# Altium schematic sheet frm-voltrod.SchDoc: MAIN
size A3; DocumentNumber: 1; SheetNumber: 1; SheetTotal: 3
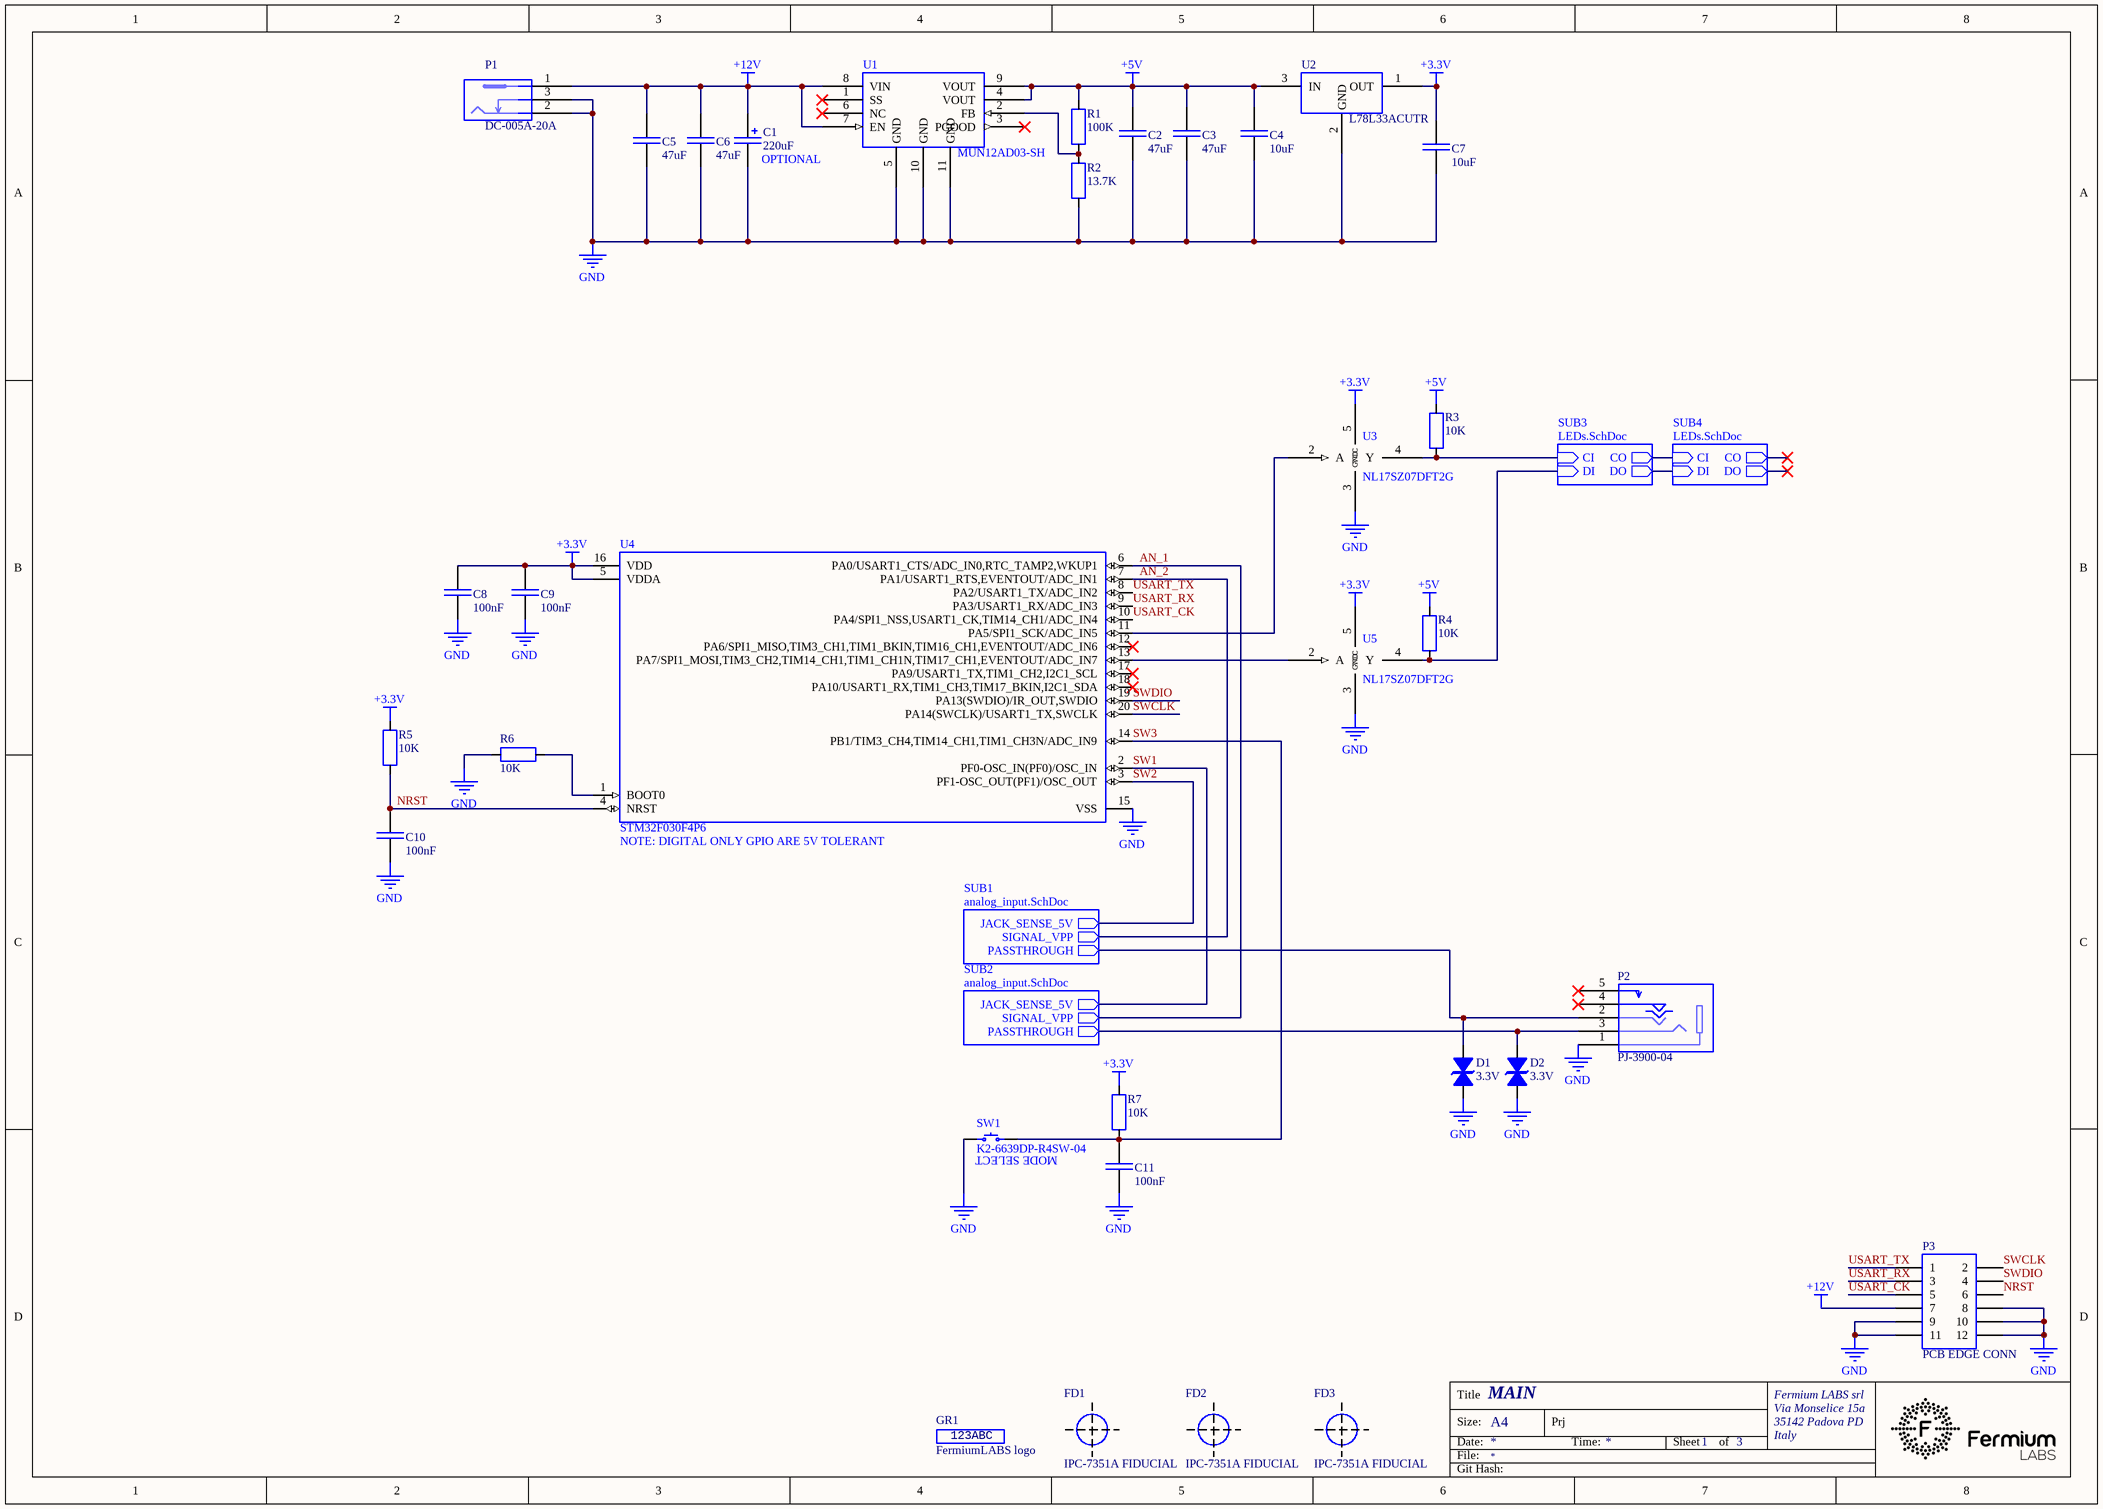
[diagram p0: frm-voltrod.SchDoc]

## Parts
C1  220uF  [3924B366-8672-45E9-B0BE-62DACC24E783]
C2  47uF  [CAP 0805_2012]
C3  47uF  [CAP 0805_2012]
C4  10uF  [CAP 0805_2012]
C5  47uF  [CAP 0805_2012]
C6  47uF  [CAP 0805_2012]
C7  10uF  [CAP 0805_2012]
C8  100nF  [CAP 0603_1608]
C9  100nF  [CAP 0603_1608]
C10  100nF  [CAP 0603_1608]
C11  100nF  [CAP 0603_1608]
D1  3.3V  [SOD523F]
D2  3.3V  [SOD523F]
FD1  IPC-7351A FIDUCIAL  [FIDUCIAL-IPC-7351A]  (no BOM)
FD2  IPC-7351A FIDUCIAL  [FIDUCIAL-IPC-7351A]  (no BOM)
FD3  IPC-7351A FIDUCIAL  [FIDUCIAL-IPC-7351A]  (no BOM)
GR1  FermiumLABS logo  [5394DE47-A0E8-4329-8464-7791B7C19310]  (no BOM)
P1  DC-005A-20A  [F0972D8A-C5C0-4A84-836D-A9666EE65C2D]
P2  PJ-3900-04  [7EF2B92C-0FC9-4C85-B662-5CEC65BFCCC4]
P3  PCB EDGE CONN
R1  100K  [RES 0603_1608]
R2  13.7K  [RES 0603_1608]
R3  10K  [RES 0603_1608]
R4  10K  [RES 0603_1608]
R5  10K  [RES 0603_1608]
R6  10K  [RES 0603_1608]
R7  10K  [RES 0603_1608]
SW1  K2-6639DP-R4SW-04  [F856BBF7-B441-4D4F-94A5-26E8A4FA0FB8]
U1  MUN12AD03-SH  [2886F06F-953A-4A60-956C-DE72111049AF]
U2  L78L33ACUTR  [E733EFB9-FE91-4AE9-9197-29251971C3DC]
U3  NL17SZ07DFT2G  [9DE955BE-AB92-4157-9666-3C064124D2CC]
U4  STM32F030F4P6  [206192DB-2106-4C81-8503-66D7D3BDF6B3]
U5  NL17SZ07DFT2G  [9DE955BE-AB92-4157-9666-3C064124D2CC]

## Sub-sheets
SUB1 = analog_input.SchDoc: JACK_SENSE_5V (out), SIGNAL_VPP (out), PASSTHROUGH (out)
SUB2 = analog_input.SchDoc: JACK_SENSE_5V (out), SIGNAL_VPP (out), PASSTHROUGH (out)
SUB3 = LEDs.SchDoc: DI (in), CI (in), DO (out), CO (out)
SUB4 = LEDs.SchDoc: DI (in), CI (in), DO (out), CO (out)

## Nets
+3.3V: C7.2 C8.2 C9.2 R5.2 R7.2 U2.1(OUT) U3.5(VCC) U4.5(VDDA) U4.16(VDD) U5.5(VCC)
+5V: C2.1 C3.1 C4.2 R1.2 R3.2 R4.2 U1.4(VOUT) U1.9(VOUT) U2.3(IN)
+12V: C1.1 C5.1 C6.1 P1.1 P3.7 U1.7(EN) U1.8(VIN)
GND: C1.2 C2.2 C3.2 C4.1 C5.2 C6.2 C7.1 C8.1 C9.1 C10.1 C11.1 D1.2 D2.2 P1.2 P1.3 P2.1(GND) P3.8 P3.9 P3.10 P3.11 P3.12 R2.1 R6.2 SW1.1 U1.5(GND) U1.10(GND) U1.11(GND) U2.2(GND) U3.3(GND) U4.15(VSS) U5.3(GND)
AN_1: U4.6(PA0/USART1_CTS/ADC_IN0,RTC_TAMP2,WKUP1) ; sheet SUB2/SIGNAL_VPP
AN_2: U4.7(PA1/USART1_RTS,EVENTOUT/ADC_IN1) ; sheet SUB1/SIGNAL_VPP
NRST: C10.2 P3.6 R5.1 U4.4(NRST)
SW1: U4.2(PF0-OSC_IN(PF0)/OSC_IN) ; sheet SUB2/JACK_SENSE_5V
SW2: U4.3(PF1-OSC_OUT(PF1)/OSC_OUT) ; sheet SUB1/JACK_SENSE_5V
SW3: C11.2 R7.1 SW1.2 U4.14(PB1/TIM3_CH4,TIM14_CH1,TIM1_CH3N/ADC_IN9)
SWCLK: P3.2 U4.20(PA14(SWCLK)/USART1_TX,SWCLK)
SWDIO: P3.4 U4.19(PA13(SWDIO)/IR_OUT,SWDIO)
USART_CK: P3.5 U4.10(PA4/SPI1_NSS,USART1_CK,TIM14_CH1/ADC_IN4)
USART_RX: P3.3 U4.9(PA3/USART1_RX/ADC_IN3)
USART_TX: P3.1 U4.8(PA2/USART1_TX/ADC_IN2)
NetD1_1: D1.1 P2.2(R) ; sheet SUB1/PASSTHROUGH
NetD2_1: D2.1 P2.3(L) ; sheet SUB2/PASSTHROUGH
NetR1_1: R1.1 R2.2 U1.2(FB)
NetR3_1: R3.1 U3.4(Y) ; sheet SUB3/CI
NetR4_1: R4.1 U5.4(Y) ; sheet SUB3/DI
NetR6_1: R6.1 U4.1(BOOT0)
NetU3_2: U3.2(A) U4.11(PA5/SPI1_SCK/ADC_IN5)
NetU4_13: U4.13(PA7/SPI1_MOSI,TIM3_CH2,TIM14_CH1,TIM1_CH1N,TIM17_CH1,EVENTOUT/ADC_IN7) U5.2(A)
(unnamed): sheet SUB3/DO, sheet SUB4/DI
(unnamed): sheet SUB3/CO, sheet SUB4/CI

Not connected (* = marked no-connect by the designer): P2 4(AUX)* 5(AUX)*; U1 1(SS)* 3(PGOOD)* 6(NC)*; U4 12(PA6/SPI1_MISO,TIM3_CH1,TIM1_BKIN,TIM16_CH1,EVENTOUT/ADC_IN6)* 17(PA9/USART1_TX,TIM1_CH2,I2C1_SCL)* 18(PA10/USART1_RX,TIM1_CH3,TIM17_BKIN,I2C1_SDA)*

## Notes on the sheet
- (near C1) OPTIONAL
- (near U4) NOTE: DIGITAL ONLY GPIO ARE 5V TOLERANT
- (near SW1) MODE SELECT
- Title
- Fermium LABS srl
- Size:
- Date:
- File:
- A4
- Prj
- Time:
- Sheet
- of
- Via Monselice 15a
- 35142 Padova PD
- Italy
- Git Hash:
- (in symbol 50f8ea88-0034-49fe-a263-d8e97bc35e2f) 123ABC

## Library data of the parts
C1 = 1a28df19-6d3e-4a71-836c-f22920f8e8ab: CAP  THT ELEC 220uF 25V 20%; Manufacturer 1: Rubycon; Manufacturer Part Number 1: 25PK220MEFC-6.3*11; id: 14782; Part Number: 1a28df19-6d3e-4a71-836c-f22920f8e8ab; ComponentLink1Description: Datasheet; ComponentLink1URL: http://localhost:8080/static/files/Rubycon-220uF-25V_C109337_12019-03-10_214953.757848.pdf?Rubycon-220uF-25V_C109337 (1).pdf; Value: 220uF
C2 C3 C5 C6 = 7e40707e-5198-472b-97ae-d9f3cd497999: CAP SMD MLCC 47uF 6.3V 0805 X5R; Manufacturer 1: Murata; Manufacturer Part Number 1: GRM21BR60J476ME15L; id: 14816; Part Number: 7e40707e-5198-472b-97ae-d9f3cd497999; Manufacturer 2: Taiyo Yuden; Manufacturer Part Number 2: JMK212BJ476MG-T; Value: 47uF
C4 C7 = 1ffbe5a9-0884-4740-bdad-20a6a98400e6: CAP SMD MLCC 10uF 25V 0805 X5R; Manufacturer 1: Samsung Electro-Mechanics; Manufacturer Part Number 1: CL21A106KAYNNNE; id: 14779; Part Number: 1ffbe5a9-0884-4740-bdad-20a6a98400e6; ComponentLink1Description: Datasheet; ComponentLink1URL: http://localhost:8080/static/files/Samsung-Electro-Mechanics-CL21A106KAYNNNE_C158502019-03-10_213827.610739.pdf?Samsung-Electro-Mechanics-CL21A106KAYNNNE_C15850.pdf; Value: 10uF; Manufacturer 2: Murata; Manufacturer Part Number 2: GRM21BR61E106KA73L
C8-C11 = 02841f84-ac15-41b5-9e17-915f8f067828: CAP SMD MLCC 100nF 25V 0603 X7R; Manufacturer 1: Samsung Electro-Mechanics; Manufacturer Part Number 1: CL10B104KA8NNNC; id: 14784; Part Number: 02841f84-ac15-41b5-9e17-915f8f067828; ComponentLink1Description: Datasheet; ComponentLink1URL: http://localhost:8080/static/files/Samsung-Electro-Mechanics-CL10B104KA8NNNC_C15902019-03-10_215548.826887.pdf?Samsung-Electro-Mechanics-CL10B104KA8NNNC_C1590.pdf; Value: 100nF
D1 D2 = d6266fd0-7428-4fb9-a062-338cdce926fd: DIODE SMD TVS 3.3V BIDIRECTIONAL SOD-523; Manufacturer 1: Born Semiconductor; Manufacturer Part Number 1: PESD3V3S1BA-N; id: 14798; Part Number: d6266fd0-7428-4fb9-a062-338cdce926fd; ComponentLink1Description: Datasheet; ComponentLink1URL: http://localhost:8080/static/files/Bourne-Semicon-Shenzhen-PESD3V3S1BA-N_C3160372019-04-07_002431.794112.pdf?Bourne-Semicon-Shenzhen-PESD3V3S1BA-N_C316037.pdf; Value: 3.3V
FD1-FD3 = 19da4612-eb95-43bb-9984-553a52b2a224: GRAPHICS FIDUCIAL IPC-7351A; id: 14800; Part Number: 19da4612-eb95-43bb-9984-553a52b2a224
GR1 = 50f8ea88-0034-49fe-a263-d8e97bc35e2f: GRAPHICS LOGO FERMIUM LABS SRL; id: 14799; Part Number: 50f8ea88-0034-49fe-a263-d8e97bc35e2f
P1 = b53db51a-1725-412b-9039-fa7a45c7c438: CONN THT DC JACK 0.5A 30VDC 5Kcycles; Manufacturer 1: HRO Electronics; id: 14780; Part Number: b53db51a-1725-412b-9039-fa7a45c7c438; ComponentLink1Description: Datasheet; ComponentLink1URL: http://localhost:8080/static/files/Korean-Hroparts-Elec-DC-005A-20A_C191049_22019-03-10_214231.486078.pdf?Korean-Hroparts-Elec-DC-005A-20A_C191049 (2).pdf; Manufacturer Part Number 1: DC-005A-20A
P2 = 80507a24-5d7c-4cf5-953e-f54832d54564: CONN THT 3.5mm AUDIO STEREO AUX SWITCH; Manufacturer 1: HRO Electronics; id: 14793; Part Number: 80507a24-5d7c-4cf5-953e-f54832d54564; ComponentLink1Description: Datasheet; ComponentLink1URL: http://localhost:8080/static/files/Korean-Hroparts-Elec-PJ-3900-04_C1518392019-04-10_231144.687617.pdf?Korean-Hroparts-Elec-PJ-3900-04_C151839.pdf; Manufacturer Part Number 1: PJ-3900-04
P3 = 54ab5b9b-caf0-4ef6-9923-0d5cbea9903e: CONN EDGE MALE PCB BRAKE-AWAY 6X2; Manufacturer 1: ---; id: 14814; Part Number: 54ab5b9b-caf0-4ef6-9923-0d5cbea9903e; Manufacturer Part Number 1: ---
R1 = 76af10b3-9d85-4b5c-a2d6-26cc74f432f7: RES SMD 100K OHM 1% 1/10W 0603; Manufacturer 1: Yageo; Manufacturer Part Number 1: RC0603FR-07100KL; id: 12746; Part Number: 76af10b3-9d85-4b5c-a2d6-26cc74f432f7; Value: 100K
R2 = 781a7ab4-3e94-4acf-a8dd-6c7705842145: RES SMD 13.7K OHM 1% 1/10W 0603; Manufacturer 1: Yageo; Manufacturer Part Number 1: RC0603FR-0713K7L; id: 12601; Part Number: 781a7ab4-3e94-4acf-a8dd-6c7705842145; Value: 13.7K
R3-R7 = 93242766-ba1d-462d-b58f-ce1dfc4129c8: RES SMD 10K OHM 1% 1/10W 0603; Manufacturer 1: Yageo; Manufacturer Part Number 1: RC0603FR-0710KL; id: 12101; Part Number: 93242766-ba1d-462d-b58f-ce1dfc4129c8; Value: 10K
SW1 = 403559d4-003c-4544-9ba1-5f60eb47cd4e: SWITCH SPST-NO TACT 6X6mm h12mm; Manufacturer 1: HRO Electronics; id: 14813; Part Number: 403559d4-003c-4544-9ba1-5f60eb47cd4e; ComponentLink1Description: Datasheet; ComponentLink1URL: http://localhost:8080/static/files/Korean-Hroparts-Elec-K2-6639DP-R4SW-04_C2237602019-04-30_164407.011391.pdf?Korean-Hroparts-Elec-K2-6639DP-R4SW-04_C223760.pdf; Manufacturer Part Number 1: K2-6639DP-R4SW-04
U1 = bc00cdda-655c-4312-be5e-62c0cd6c1179: IC DC-DC MODULE REG  4.5-16Vin  0.6-5.0Vout 3A 91%; Manufacturer 1: Cyntec; id: 14815; Part Number: bc00cdda-655c-4312-be5e-62c0cd6c1179; ComponentLink1Description: Datasheet; ComponentLink1URL: http://localhost:8080/static/files/Cyntec-MUN12AD03-SH_C2187872019-04-30_184821.018556.pdf?Cyntec-MUN12AD03-SH_C218787.pdf; Manufacturer Part Number 1: MUN12AD03-SH
U2 = 8cc975d7-ef9f-4621-a9d5-14e4ba8cc85a: IC SMD LINEAR VOLTAGE REGULATOR 3.3V 100mA SOT-89; Manufacturer 1: ST Microelectronics; id: 14809; Part Number: 8cc975d7-ef9f-4621-a9d5-14e4ba8cc85a; ComponentLink1Description: Datasheet; ComponentLink1URL: http://localhost:8080/static/files/STMicroelectronics-L78L33ACUTR_C141702019-04-29_215238.249911.pdf?STMicroelectronics-L78L33ACUTR_C14170.pdf; Manufacturer 2: Diodes Inc.; Manufacturer Part Number 1: L78L33ACUTR; Manufacturer Part Number 2: AZ1117R-3.3TRE1
U3 U5 = a3d656f3-fbd6-4576-b355-9fd6caec7ecf: IC SMD BUFFER NON-INVERTING OPEN-DRAIN SOT-353; Manufacturer 1: ON Semiconductor; id: 14811; Part Number: a3d656f3-fbd6-4576-b355-9fd6caec7ecf; ComponentLink1Description: Datasheet; ComponentLink1URL: http://localhost:8080/static/files/ON-Semicon-ON-NL17SZ07DFT2G_C1132552019-04-29_221711.207916.pdf?ON-Semicon-ON-NL17SZ07DFT2G_C113255.pdf; Manufacturer Part Number 1: NL17SZ07DFT2G
U4 = 6654dce5-3670-4880-9fa3-4487e523ee9f: IC SMD MICROCONTROLLER STM32F030F4P6 16KB 4KB TSSOP-20; Manufacturer 1: ST Microelectronics; id: 14810; Part Number: 6654dce5-3670-4880-9fa3-4487e523ee9f; ComponentLink1Description: Datasheet; ComponentLink1URL: http://localhost:8080/static/files/STMicroelectronics-STM32F030F4P6-datasheet2019-04-29_220653.008229.pdf?STMicroelectronics-STM32F030F4P6-datasheet.pdf; Manufacturer Part Number 1: STM32F030F4P6